# Altium schematic sheet plata_sredn.SchDoc
size A4
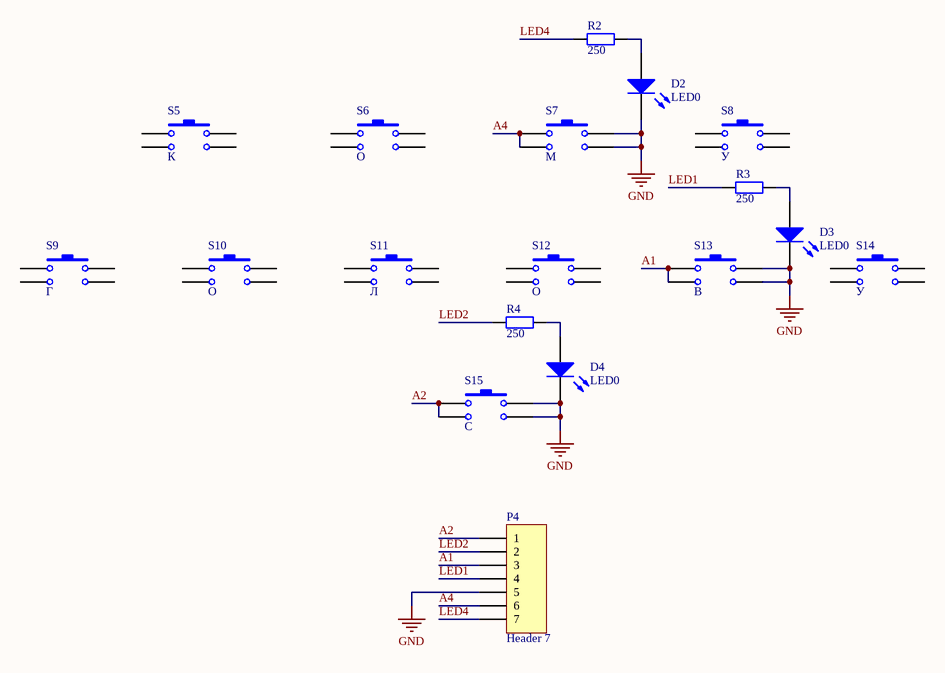
[diagram p0: plata_sredn.SchDoc]

## Parts
D2  LED0  [LED0805]
D3  LED0  [LED0805]
D4  LED0  [LED0805]
P4  Header 7  [HDR1X7]
R2  250  [6-0805_N]
R3  250  [6-0805_N]
R4  250  [6-0805_N]
S5  К  [STMW]
S6  О  [STMW]
S7  М  [STMW]
S8  У  [STMW]
S9  Г  [STMW]
S10  О  [STMW]
S11  Л  [STMW]
S12  О  [STMW]
S13  В  [STMW]
S14  У  [STMW]
S15  С  [STMW]

## Nets
GND: D2.2(K) D3.2(K) D4.2(K) P4.5 S7.2 S13.2 S15.2
A1: P4.3 S13.1
A2: P4.1 S15.1
A4: P4.6 S7.1
LED1: P4.4 R3.2
LED2: P4.2 R4.2
LED4: P4.7 R2.2
NetD2_1: D2.1(A) R2.1
NetD3_1: D3.1(A) R3.1
NetD4_1: D4.1(A) R4.1

Not connected (* = marked no-connect by the designer): S5 1 2; S6 1 2; S8 1 2; S9 1 2; S10 1 2; S11 1 2; S12 1 2; S14 1 2

## Library data of the parts
D2-D4 = LED0: Typical INFRARED GaAs LED; Published: 8-Jun-2000; LatestRevisionDate: 08-Jul-2005; LatestRevisionNote: Mech Layer 1 removed.; PackageReference: LED-0; Publisher: Altium Limited; PackageDescription: LED; 2 Leads
P4 = Header 7: Header, 7-Pin; LatestRevisionDate: 17-Jul-2002; LatestRevisionNote: Re-released for DXP Platform.; Publisher: Altium Limited
R2-R4 = Res2: Resistor; Value: 1K; Published: 8-Jun-2000; LatestRevisionDate: 17-Jul-2002; LatestRevisionNote: Re-released for DXP Platform.; PackageReference: AXIAL-0.4; Publisher: Altium Limited; PackageDescription: Axial Device, Thru-Hole; 2 Leads; 0.4 in Pin Spacing
S5-S15 = STMW: Switch; Published: 24-Mar-1999; LatestRevisionDate: 17-Jul-2002; LatestRevisionNote: Re-released for DXP Platform.; PackageReference: SPST-2; Publisher: Altium Limited; PackageDescription: Switch; 2 Leads